# Altium schematic sheet Debug.SchDoc
size A3; SheetNumber: 1; SheetTotal: 1; PageSetup: Record=PageOptions|CenterHorizontal=True|CenterVertical=True|PrintScale=0.97|XCorrection=1.00|YCorrection=1.00|PrintKind=1|BorderSize=5000000|LeftOffset=0|BottomOffset=0|Orientation=2|PaperLength=2970|PaperWidth=2100|Scale=100|PaperSource=7|PrintQuality=600|MediaType=1|DitherType=10|PaperKind=A4|PrintScaleMode=1
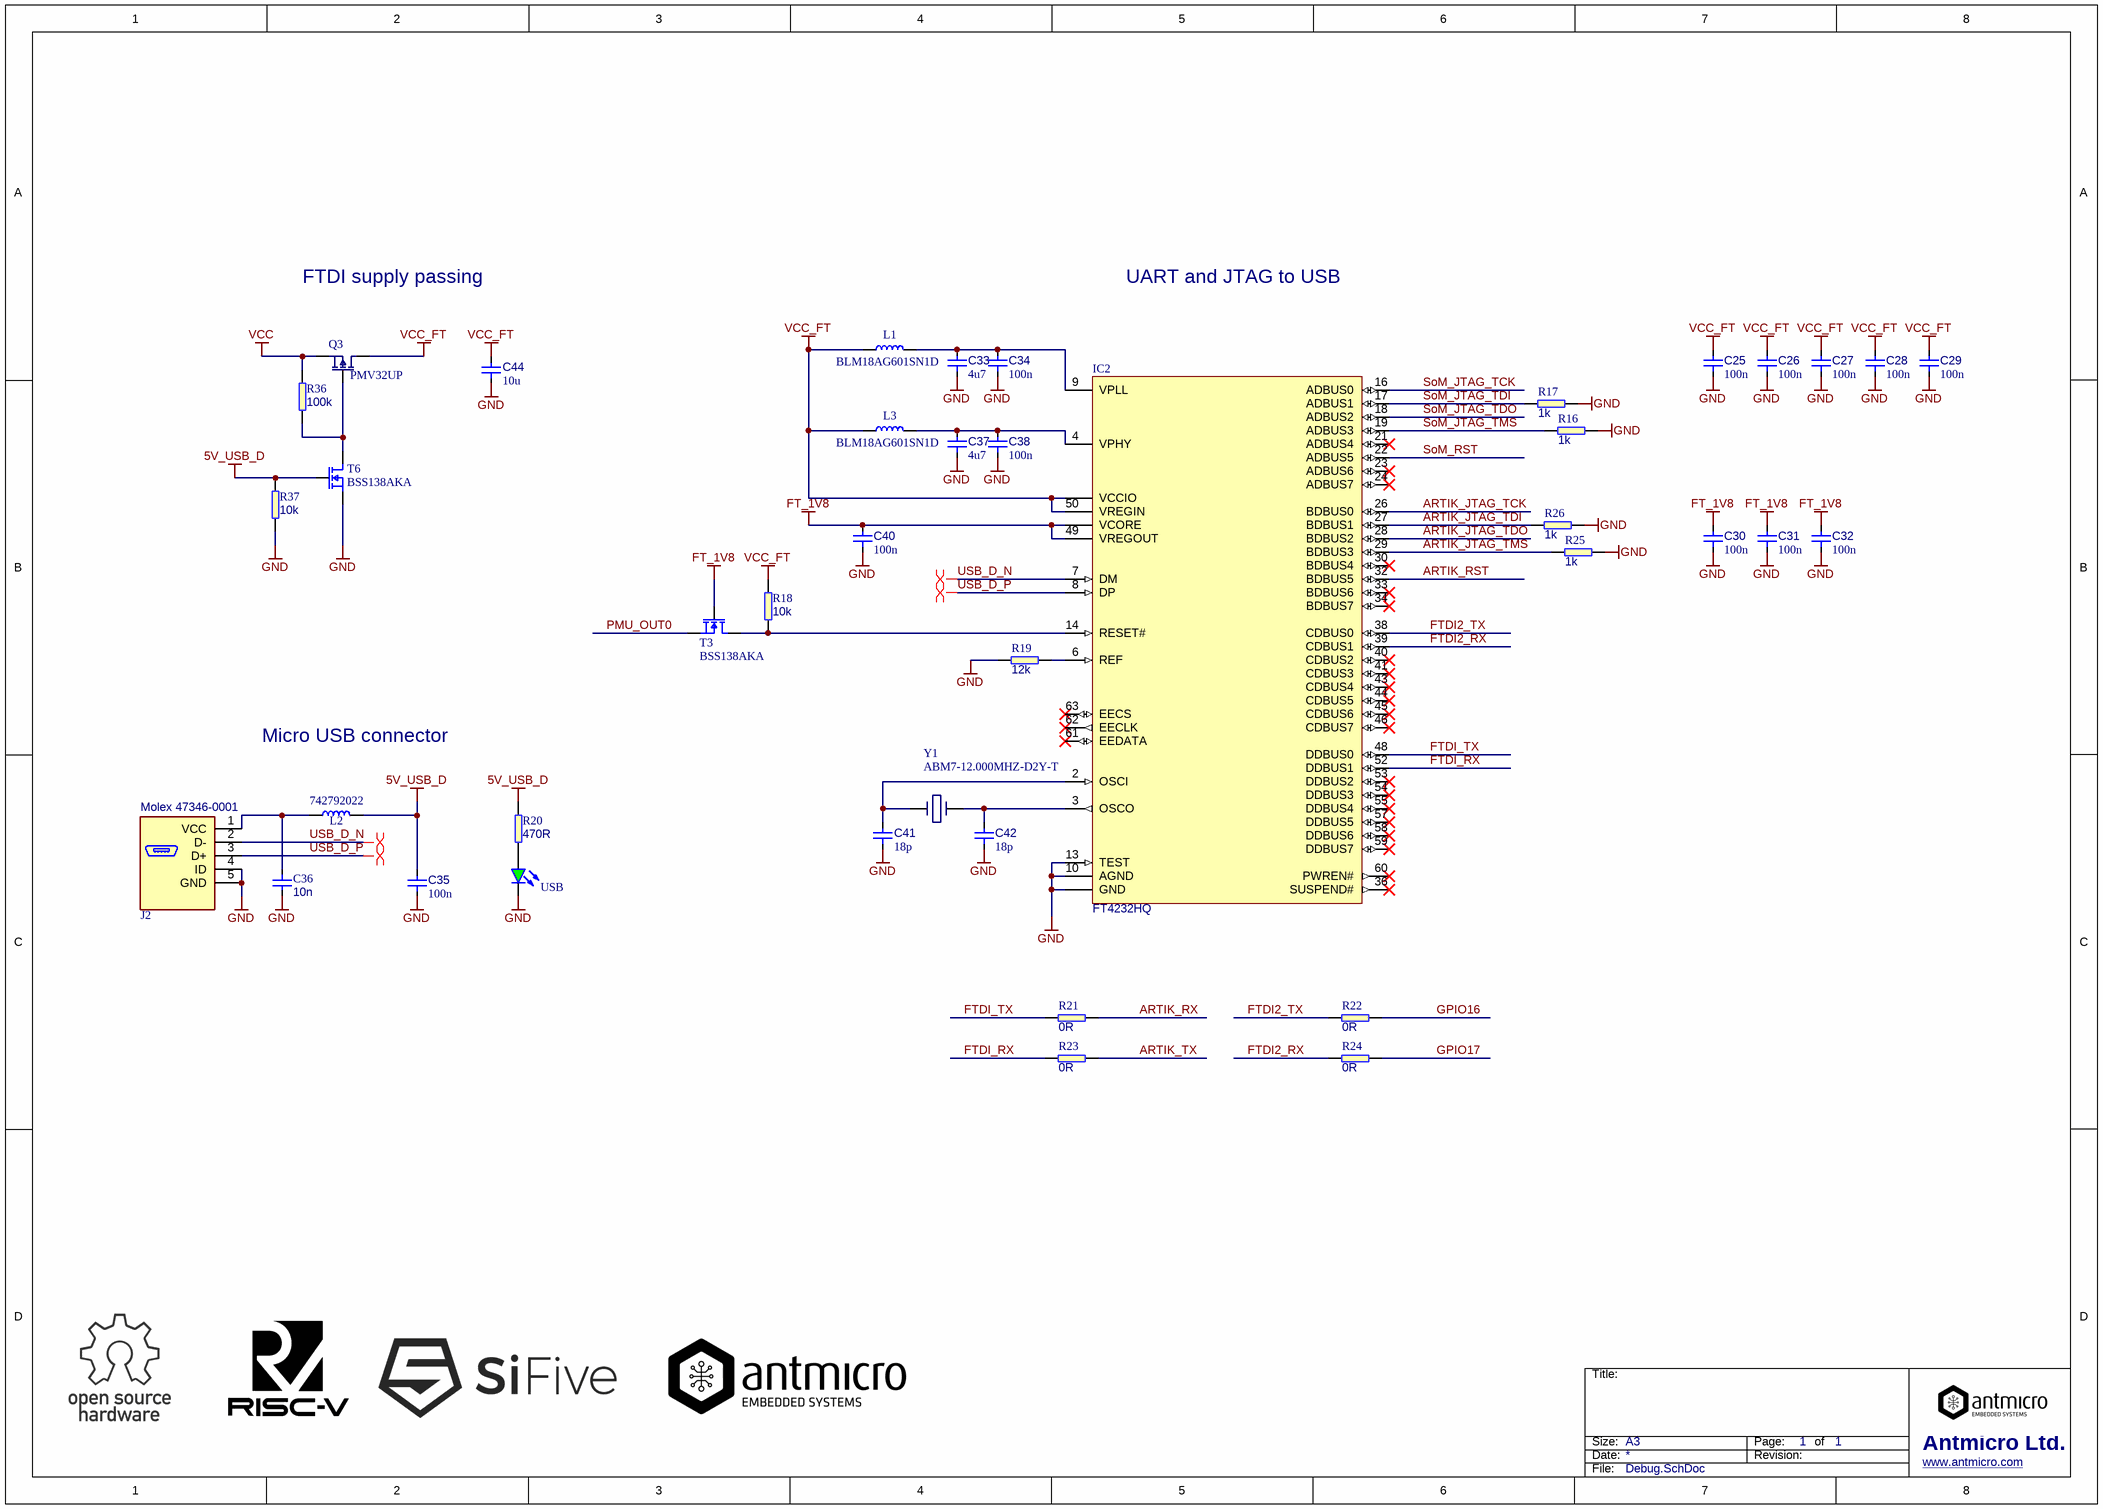
[diagram p0: Debug.SchDoc]

## Parts
C25  100n  [0402]
C26  100n  [0402]
C27  100n  [0402]
C28  100n  [0402]
C29  100n  [0402]
C30  100n  [0402]
C31  100n  [0402]
C32  100n  [0402]
C33  4u7  [0402]
C34  100n  [0402]
C35  100n  [0603]
C36  10n  [0603]
C37  4u7  [0402]
C38  100n  [0402]
C40  100n  [0402]
C41  18p  [0402]
C42  18p  [0402]
C44  10u  [0402]
IC2  FT4232HQ  [FT2232HQ]
J2  Molex 47346-0001  [CON-Molex-047346-0001]
L1  BLM18AG601SN1D  [0603]
L2  742792022  [0805]
L3  BLM18AG601SN1D  [0603]
Q3  PMV32UP  [SOT-23]
R16  1k  [0402]
R17  1k  [0402]
R18  10k  [0402]
R19  12k  [0402]
R20  470R  [0603]
R21  0R  [0603]
R22  0R  [0603]
R23  0R  [0603]
R24  0R  [0603]
R25  1k  [0402]
R26  1k  [0402]
R36  100k  [0402]
R37  10k  [0402]
T3  BSS138AKA  [SOT-23]
T6  BSS138AKA  [SOT-23]
USB  KPT-1608SGC  [LED0603]  (value not drawn)
Y1  value ABM7-12.000MHZ-D2Y-T  [abm7]  (hidden comment: ABRACON - ABM7-12.000MHZ-D2Y-T - CRYSTAL, 12MHZ, 18PF, SMD)

## Nets
5V_USB_D: C35.2 L2.1 R20.2 R37.1 T6.1(G)
FT_1V8: C30.2 C31.2 C32.2 C40.2 IC2.49(VREGOUT) IC2.VCORE T3.1(G)
GND: C25.1 C26.1 C27.1 C28.1 C29.1 C30.1 C31.1 C32.1 C33.1 C34.1 C35.1 C36.2 C37.1 C38.1 C40.1 C41.1 C42.1 C44.1 IC2.10(AGND) IC2.13(TEST) IC2.GND J2.4(ID) J2.5(GND) R16.1 R17.1 R19.1 R25.1 R26.1 R37.2 T6.2(S) USB.K
VCC: Q3.2(S) R36.2
VCC_FT: C25.2 C26.2 C27.2 C28.2 C29.2 C44.2 IC2.50(VREGIN) IC2.VCCIO L1.1 L3.1 Q3.3(D) R18.1
ARTIK_JTAG_TCK: IC2.26(BDBUS0)
ARTIK_JTAG_TDI: IC2.27(BDBUS1) R26.2
ARTIK_JTAG_TDO: IC2.28(BDBUS2)
ARTIK_JTAG_TMS: IC2.29(BDBUS3) R25.2
ARTIK_RST: IC2.32(BDBUS5)
ARTIK_RX: R21.2
ARTIK_TX: R23.2
FTDI2_RX: IC2.39(CDBUS1) R24.1
FTDI2_TX: IC2.38(CDBUS0) R22.1
FTDI_RX: IC2.52(DDBUS1) R23.1
FTDI_TX: IC2.48(DDBUS0) R21.1
GPIO16: R22.2
GPIO17: R24.2
PMU_OUT0: T3.2(S)
SoM_JTAG_TCK: IC2.16(ADBUS0)
SoM_JTAG_TDI: IC2.17(ADBUS1) R17.2
SoM_JTAG_TDO: IC2.18(ADBUS2)
SoM_JTAG_TMS: IC2.19(ADBUS3) R16.2
SoM_RST: IC2.22(ADBUS5)
USB_D_N: IC2.7(DM) J2.2(D-)
USB_D_P: IC2.8(DP) J2.3(D+)
NetC33_2: C33.2 C34.2 IC2.9(VPLL) L1.2
NetC36_1: C36.1 J2.1(VCC) L2.2
NetC37_2: C37.2 C38.2 IC2.4(VPHY) L3.2
NetC41_2: C41.2 IC2.2(OSCI) Y1.2
NetC42_2: C42.2 IC2.3(OSCO) Y1.1
NetIC2_6: IC2.6(REF) R19.2
NetIC2_14: IC2.14(RESET#) R18.2 T3.3(D)
NetQ3_1: Q3.1(G) R36.1 T6.3(D)
NetR20_1: R20.1 USB.A

Not connected (* = marked no-connect by the designer): IC2 21(ADBUS4)* 23(ADBUS6)* 24(ADBUS7)* 30(BDBUS4)* 33(BDBUS6)* 34(BDBUS7)* 36(SUSPEND#)* 40(CDBUS2)* 41(CDBUS3)* 43(CDBUS4)* 44(CDBUS5)* 45(CDBUS6)* 46(CDBUS7)* 53(DDBUS2)* 54(DDBUS3)* 55(DDBUS4)* 57(DDBUS5)* 58(DDBUS6)* 59(DDBUS7)* 60(PWREN#)* 61(EEDATA)* 62(EECLK)* 63(EECS)*

## Layout directives
differential pair: USB_D_N, USB_D_P

## Notes on the sheet
- FTDI supply passing
- UART and JTAG to USB
- Micro USB connector
- Title:
- Size:
- Date:
- A3
- Revision:
- Page:
- of
- Antmicro Ltd.
- File:
- www.antmicro.com

## Library data of the parts
C25-C32 C34 C38 C40 = C_100n_0402: MLCC SMT Capacitor 100nF 0402; Manufacturer: MULTICOMP; Part Symbol: MC0402X104M100CT; Part Number: C_100n_0402; Value: 100n
C33 C37 = C_4u7_0402: MLCC SMT Capacitor 4u7 0402; Manufacturer: MURATA; Part Symbol: GRM155R60G475ME; Part Number: C_4u7_0402; Value: 4u7
C35 = C_100n_0603: MLCC SMT Capacitor 100nF 0603; Manufacturer: WALSIN; Part Symbol: 0603B104K500CT; Value: 100n; Part Number: C_100n_0603
C36 = C_10n_0603: MLCC SMT Capacitor 10n 0603; Manufacturer: AVX; Part Symbol: 06031C103JAT2A; Value: 10n; Part Number: C_10n_0603
C41 C42 = C_18p_0402: MLCC SMT Capacitor 18pF 0402; Manufacturer: KEMET; Part Symbol: C0402C180J5GACAUTO; Part Number: C_18p_0402; Value: 18p
C44 = C_10u_0402: MLCC SMT Capacitor 10uF 0402; Manufacturer: TDK; Part Symbol: C1005X5R0J106M050BC; Value: 10u; Part Number: C_10u_0402
IC2 = FT4232HQ: FTDI  FT4232HQ-R  Interface Bridges, USB to UART, MPSSE, 1.62 V, 1.98 V, QFN, 64 Pins, -40 °C; Part Number: FT4232HQ; Value: FT4232HQ; Manufacturer: FTDI; Part Symbol: FT4232HQ-R
J2 = Micro USB B: USB - micro B Receptacle Connector 5 Position Surface Mount, Right Angle, Horizontal; Part Number: CON-Molex-47346-0001; Part Symbol: 473460001; Value: Molex 47346-0001; Manufacturer: Molex
L1 L3 = Inductor SMT_0603: Ferrite Bead, 600 ohm, 0603 [1608 Metric], BLM18A Series, 500 mA, 0.38 ohm, ± 25%; Manufacturer: MURATA; Part Number: BLM18AG601SN1D; Value: BLM18AG601SN1D; Part Symbol: BLM18AG601SN1D
L2 = Inductor SMT_0805: WURTH ELEKTRONIK - 742792022 - FERRITE BEAD, 0.05OHM, 2A, 0805; Part Number: 742792022; Value: 742792022; Manufacturer: WURTH ELEKTRONIK; Part Symbol: 742792022
Q3 = PMOS: P CH, 20V, 4A; Manufacturer: NXP; Part Number: PMV32UP; Value: PMV32UP; Part Symbol: PMV32UP
R16 R17 R25 R26 = R_1k_0402: RES, 1k, 0402; Manufacturer: MULTICOMP; Part Symbol: MCMR04X1001FTL; Part Number: R_1k_0402; Value: 1k
R18 R37 = R_10k_0402: RES, 10k, 0402; Manufacturer: MULTICOMP; Part Symbol: MCMR04X1002FTL; Part Number: R_10k_0402; Value: 10k
R19 = R_12k_0402: RES, 12k 0402; Manufacturer: VISHAY; Part Symbol: CRCW040212K0FKEDHP; Part Number: R_12k_0402; Value: 12k
R20 = R_470R_0603: RES, 470R, 0603; Manufacturer: BOURNS; Part Symbol: CR0603-JW-471GLF; Part Number: R_470R_0603; Value: 470R
R21-R24 = R_0R_0603: RES, 0R, 0603; Manufacturer: BOURNS; Part Symbol: CR0603-J/-000ELF; Part Number: R_0R_0603; Value: 0R
R36 = R_100k_0402: RES, 100k 0402; Manufacturer: VISHAY; Part Symbol: CRCW0402100KFKEDHP; Part Number: R_100k_0402; Value: 100k
T3 T6 = NMOS: MOSFET, N CH, 60V, 0.2A; Part Number: BSS138; Manufacturer: NXP; Value: BSS138AKA; Part Symbol: BSS138AKA
USB = LED: LED Green 0603 case; Part Number: LED_G; Manufacturer: KINGBRIGHT; Value: KPT-1608SGC; Part Symbol: KPT-1608SGC
Y1 = CRYSTAL: CRYSTAL, 12MHZ, 18PF, SMD; Part Number: CRYSTAL_12MHz_SMD_6.0x3.5mm; Manufacturer: ABRACON; Part Symbol: ABM7-12.000MHZ-D2Y-T